# EAGLE design openLRS-APM (EAGLE 6.5.0)
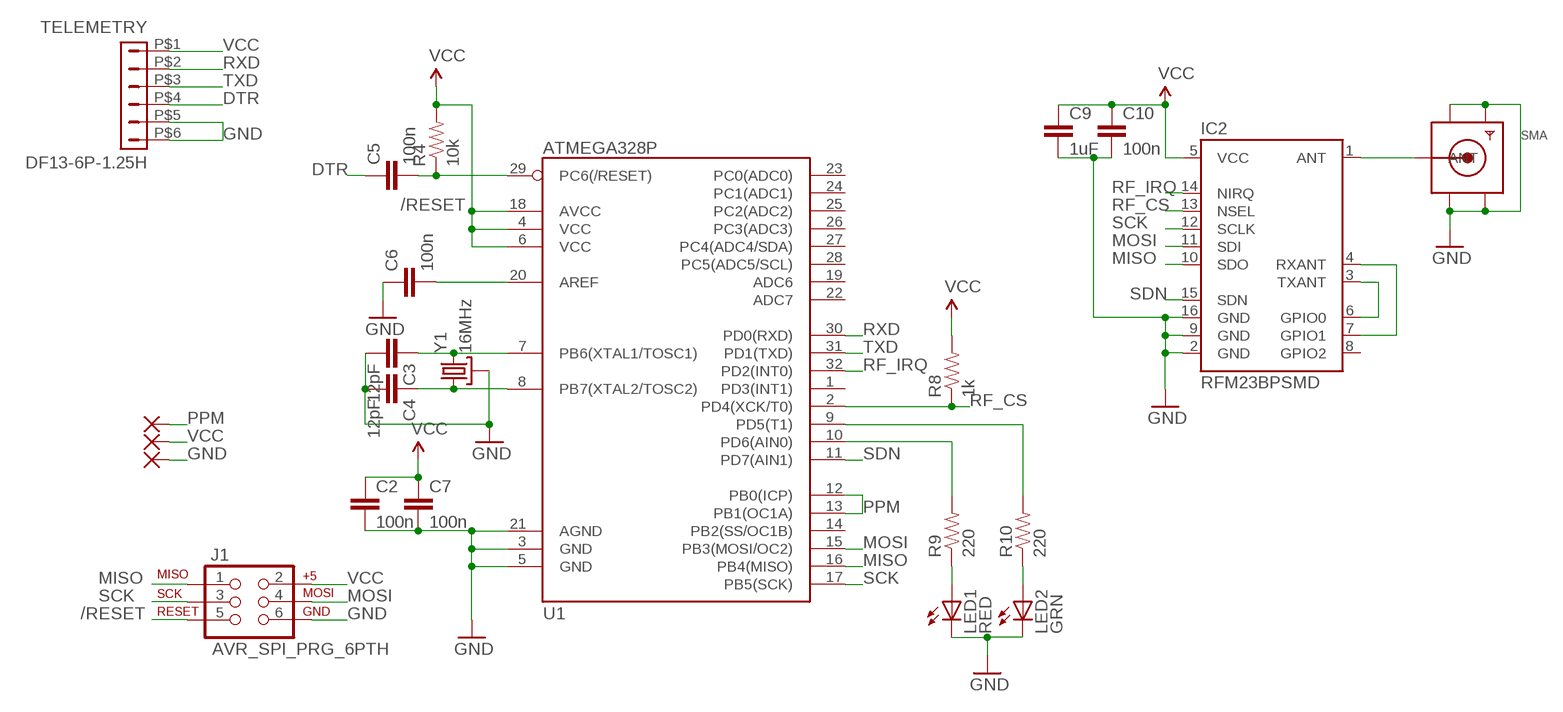
[diagram p0: schematic, sheet 1]

## Parts
C2  100n  CAP0805  [0805]
C3  12pF  CAP0805  [0805]
C4  12pF  CAP0805  [0805]
C5  100n  CAP0805  [0805]
C6  100n  CAP0805  [0805]
C7  100n  CAP0805  [0805]
C9  1uF  CAP0805  [0805]
C10  100n  CAP0805  [0805]
GND  WIREPADSMD1,27-254  [SMD1,27-2,54]
IC2  RFM23BPSMD  [RFM23BP-S2]
J1  AVR_SPI_PRG_6PTH  [2X3]
LED1  RED  LEDSML0805  [SML0805]
LED2  GRN  LEDSML0805  [SML0805]
PPM  WIREPADSMD1,27-254  [SMD1,27-2,54]
R4  10k  RESISTOR0805-RES  [0805]
R8  1k  RESISTOR0805-RES  [0805]
R9  220  RESISTOR0805-RES  [0805]
R10  220  RESISTOR0805-RES  [0805]
SMA  SMACONNECTOR_EDGE  [SMA_EDGELAUNCH]
TELEMETRY  DF13-6P-1.25H  [DF13A-6P-1.25H]
U1  ATMEGA328P  ATMEGA328_SMT  [TQFP32-08]
VCC  WIREPADSMD1,27-254  [SMD1,27-2,54]
Y1  16MHz  CRYSTAL3.2X2.5  [CRYSTAL-SMD-5X3]

## Nets
/RESET: C5.2 J1.5 R4.1 U1.29(PC6(/RESET))
DTR: C5.1 TELEMETRY.P$4
GND: C2.2 C3.2 C4.2 C6.1 C7.2 C9.2 C10.2 GND.1(P) IC2.2(GND) IC2.9(GND) IC2.16(GND) J1.6 LED1.C LED2.C SMA.GND@1(GND4) SMA.GND@2(GND3) SMA.GND@3(GND2) SMA.GND@4(GND1) TELEMETRY.P$5 TELEMETRY.P$6 U1.3(GND) U1.5(GND) U1.21(AGND) Y1.2(GND) Y1.4(GND)
MISO: IC2.10(SDO) J1.1 U1.16(PB4(MISO))
MOSI: IC2.11(SDI) J1.4 U1.15(PB3(MOSI/OC2))
N$1: IC2.3(TXANT) IC2.6(GPIO0)
N$2: IC2.4(RXANT) IC2.7(GPIO1)
N$7: R9.2 U1.10(PD6(AIN0))
N$8: R10.2 U1.9(PD5(T1))
N$9: LED2.A R10.1
N$10: LED1.A R9.1
N$11: C3.1 U1.7(PB6(XTAL1/TOSC1)) Y1.3
N$12: C4.1 U1.8(PB7(XTAL2/TOSC2)) Y1.1
N$13: IC2.1(ANT) SMA.P(ANT)
N$14: C6.2 U1.20(AREF)
PPM: PPM.1(P) U1.12(PB0(ICP)) U1.13(PB1(OC1A))
RF_CS: IC2.13(NSEL) R8.1 U1.2(PD4(XCK/T0))
RF_IRQ: IC2.14(NIRQ) U1.32(PD2(INT0))
RXD: TELEMETRY.P$2 U1.30(PD0(RXD))
SCK: IC2.12(SCLK) J1.3 U1.17(PB5(SCK))
SDN: IC2.15(SDN) U1.11(PD7(AIN1))
TXD: TELEMETRY.P$3 U1.31(PD1(TXD))
VCC: C2.1 C7.1 C9.1 C10.1 IC2.5(VCC) J1.2 R4.2 R8.2 TELEMETRY.P$1 U1.4(VCC) U1.6(VCC) U1.18(AVCC) VCC.1(P)
Unconnected: IC2.8(GPIO2) U1.1(PD3(INT1)) U1.14(PB2(SS/OC1B)) U1.19(ADC6) U1.22(ADC7) U1.23(PC0(ADC0)) U1.24(PC1(ADC1)) U1.25(PC2(ADC2)) U1.26(PC3(ADC3)) U1.27(PC4(ADC4/SDA)) U1.28(PC5(ADC5/SCL))

## Library data of the parts
C2-C7 C9 C10 = SparkFun-Capacitors:CAP: Capacitor Standard 0603 ceramic capacitor, and 0.1" leaded capacitor.
GND PPM VCC = wirepad:WIREPAD: Wire PAD connect wire on PCB
IC2 = RFM23:RFM23BP: The RFM23BP is a medium power, low cost radio that is capable of operating in the 434MHz and 900MHz open bands. It's frequency is software defined and there are some very good libraries written for it.
J1 = SparkFun-Connectors:AVR_SPI_PRG_6: AVR ISP 6 Pin This is the reduced ISP connector for AVR programming. Common on Arduino. This footprint will take up less PCB space and can be used with a 10-pin to 6-pin adapter such as SKU: BOB-08508
LED1 LED2 = led:LED: LED OSRAM: - CHIPLED LG R971, LG N971, LY N971, LG Q971, LY Q971, LO R971, LY R971 LH N974, LH R974 LS Q976, LO Q976, LY Q976 LO Q996 - Hyper CHIPLED LW Q18S LB Q993, LB Q99A, LB R99A - SideLED LS A670, LO A670, LY A670, LG A670, LP A670 LB A673, LV A673, LT A673, LW A673 LH A674 LY A675 LS A676, LA A676, LO A676, LY A676, LW A676 LS A679, LY A679, LG A679 - Hyper Micro SIDELED® LS Y876, LA Y876, LO Y876, LY Y876 LT Y87S - SmartLED LW L88C, LW L88S LB L89C, LB L89S, LG L890 LS L89K, LO L89K, LY L89K LS L896, LA L896, LO L896, LY L896 - TOPLED LS T670, LO T670, LY T670, LG T670, LP T670 LSG T670, LSP T670, LSY T670, LOP T670, LYG T670 LG T671, LOG T671, LSG T671 LB T673, LV T673, LT T673, LW T673 LH T674 LS T676, LA T676, LO T676, LY T676, LB T676, LH T676, LSB T676, LW T676 LB T67C, LV T67C, LT T67C, LS T67K, LO T67K, LY T67K, LW E67C LS E67B, LA E67B, LO E67B, LY E67B, LB E67C, LV E67C, LT E67C LW T67C LS T679, LY T679, LG T679 LS T770, LO T770, LY T770, LG T770, LP T770 LB T773, LV T773, LT T773, LW T773 LH T774 LS E675, LA E675, LY E675, LS T675 LS T776, LA T776, LO T776, LY T776, LB T776 LHGB T686 LT T68C, LB T68C - Hyper Mini TOPLED® LB M676 - Mini TOPLED Santana® LG M470 LS M47K, LO M47K, LY M47K Source: http://www.osram.convergy.de LUXEON: - LUMILED® LXK2-PW12-R00, LXK2-PW12-S00, LXK2-PW14-U00, LXK2-PW14-V00 LXK2-PM12-R00, LXK2-PM12-S00, LXK2-PM14-U00 LXK2-PE12-Q00, LXK2-PE12-R00, LXK2-PE12-S00, LXK2-PE14-T00, LXK2-PE14-U00 LXK2-PB12-K00, LXK2-PB12-L00, LXK2-PB12-M00, LXK2-PB14-N00, LXK2-PB14-P00, LXK2-PB14-Q00 LXK2-PR12-L00, LXK2-PR12-M00, LXK2-PR14-Q00, LXK2-PR14-R00 LXK2-PD12-Q00, LXK2-PD12-R00, LXK2-PD12-S00 LXK2-PH12-R00, LXK2-PH12-S00 LXK2-PL12-P00, LXK2-PL12-Q00, LXK2-PL12-R00 Source: www.luxeon.com KINGBRIGHT: KA-3528ASYC Source: www.kingbright.com
R4 R8-R10 = SparkFun-Resistors:RESISTOR: Resistor Basic schematic elements and footprints for 0603, 1206, and PTH resistors.
SMA = adafruit:SMACONNECTOR: SMA Connector 90° DIP SMA Connector, 50 Ohm (4UConnector: 07259)
TELEMETRY = con-hirose-df13:DF13-6P-1.25: DF13-6P 1.25mm Pitch Miniature Crimping Connector.
U1 = SparkFun-DigitalIC:ATMEGA328_SMT: 32-Pin Atmega328 part Commonly used on Arduino compatible boards Available in QFP and QFN packages TQFP is IC-09069 QFN is non-stock; PROD_ID: IC-09069
Y1 = crystal_3225:CRYSTAL: Various standard crystals. Proven footprints. Spark Fun Electronics SKU : COM-00534

## Net classes
0 default: clearance 0.205 mm

## Board
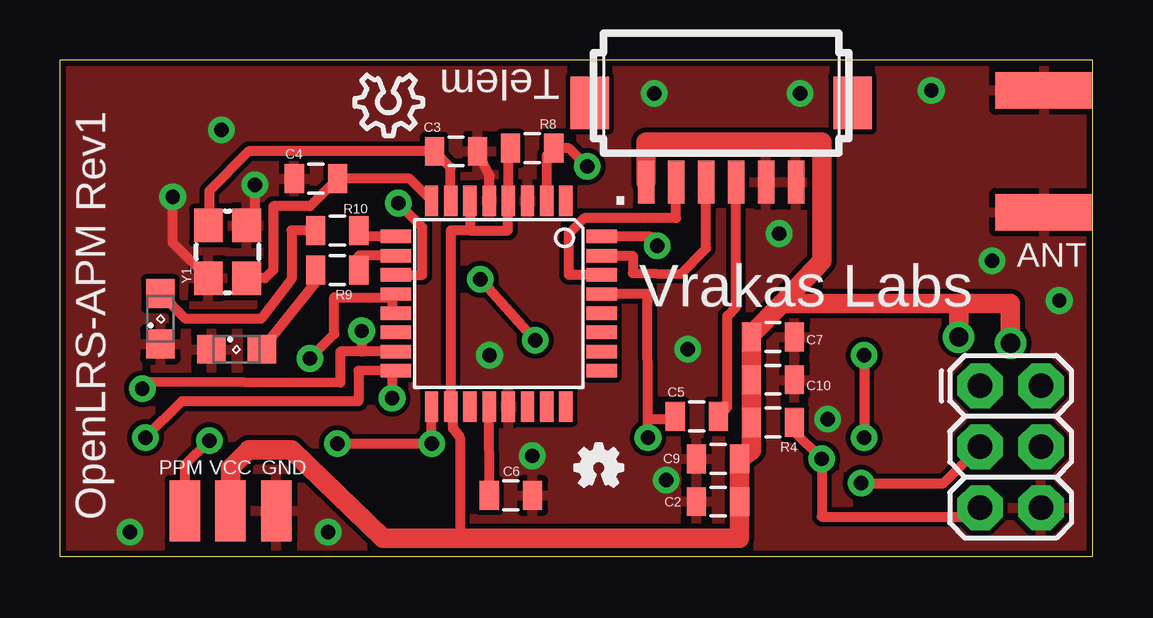
[diagram p1: board, top side]
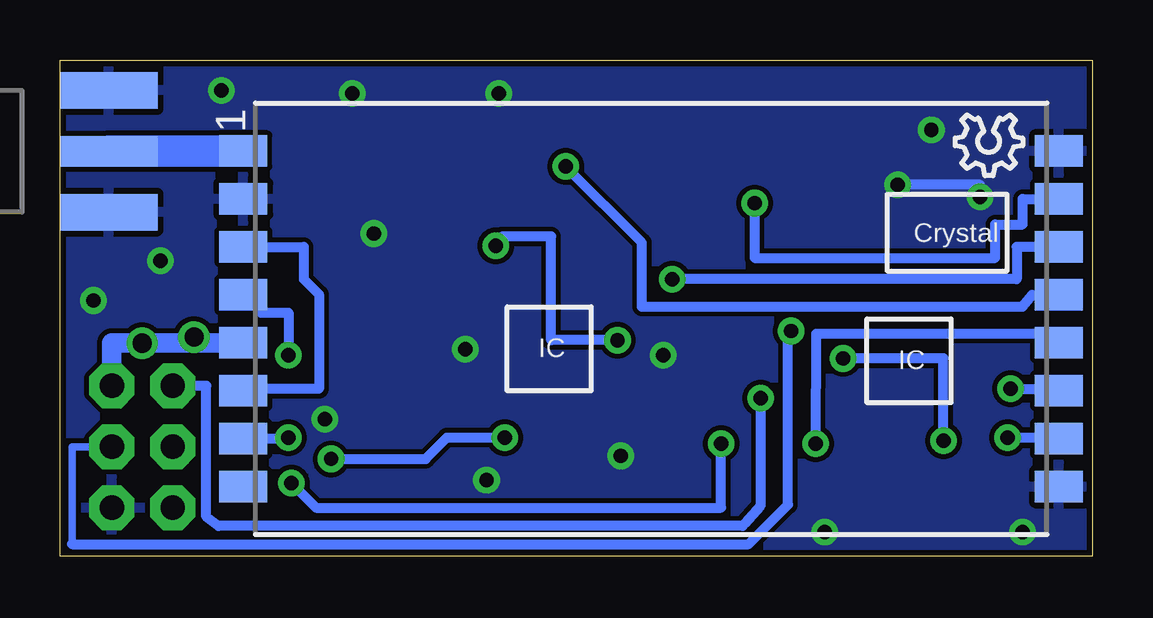
[diagram p2: board, bottom side, seen from below]

Size 43.05 x 20.7 mm. Coordinates in mm from the lower left corner, seen from the top.
Outline: 0,0 0,20.7 43.05,20.7 43.05,0 0,0
Copper layers (1*16): Top 0.035mm / dielectric 1.5mm / Bottom 0.035mm
Design rules "SparkFun": minimum track width 8mil, minimum drill 20mil, track to track 8mil, track to pad 8mil, pad to pad 8mil, via to via 8mil, smd to smd 8mil, copper to edge 10mil, drill to drill 8mil, minimum pad ring 12mil, minimum via ring 10mil, stop-mask expansion 4mil, vias tented up to drill 25mil, thermal gap 10mil

### Footprints (pad centres in the part's own frame; a part is rotated, then mirrored left to right if it is on the bottom)
0805 = smd 0.8 x 1.2: 1 -0.9,0; 2 0.9,0
SMD1,27-2,54 = smd 1.27 x 2.54: 1 0,0
RFM23BP-S2 = smd 2 x 1.3: 1 -17,7; 2 -17,5; 3 -17,3; 4 -17,1; 5 -17,-1; 6 -17,-3; 7 -17,-5; 8 -17,-7; 9 17,-7; 10 17,-5; 11 17,-3; 12 17,-1; 13 17,1; 14 17,3; 15 17,5; 16 17,7
2X3 = drill 1.016 pad 1.88 octagon: 1 0,0; 2 0,2.54; 3 2.54,0; 4 2.54,2.54; 5 5.08,0; 6 5.08,2.54
SML0805 = smd 1.2 x 1.2: A 1.05,0; C -1.05,0
SMA_EDGELAUNCH = smd 4.064 x 1.524: GND@1 2.032,-2.54; GND@2 2.032,2.54 | smd 4.064 x 1.524 bottom: GND@3 2.032,2.54; GND@4 2.032,-2.54 | smd 4.064 x 1.27: P 2.032,0
DF13A-6P-1.25H = smd 1.6 x 2.2: M$0 -5.475,2.4; M$1 5.475,2.4 | smd 0.7 x 1.8: P$1 -3.125,-0.9; P$2 -1.875,-0.9; P$3 -0.625,-0.9; P$4 0.625,-0.9; P$5 1.875,-0.9; P$6 3.125,-0.9
TQFP32-08 = smd 1.27 x 0.559: 1 -4.293,2.8; 2 -4.293,2; 3 -4.293,1.2; 4 -4.293,0.4; 5 -4.293,-0.4; 6 -4.293,-1.2; 7 -4.293,-2; 8 -4.293,-2.8; 17 4.293,-2.8; 18 4.293,-2; 19 4.293,-1.2; 20 4.293,-0.4; 21 4.293,0.4; 22 4.293,1.2; 23 4.293,2; 24 4.293,2.8 | smd 0.559 x 1.27: 9 -2.8,-4.293; 10 -2,-4.293; 11 -1.2,-4.293; 12 -0.4,-4.293; 13 0.4,-4.293; 14 1.2,-4.293; 15 2,-4.293; 16 2.8,-4.293; 25 2.8,4.293; 26 2,4.293; 27 1.2,4.293; 28 0.4,4.293; 29 -0.4,4.293; 30 -1.2,4.293; 31 -2,4.293; 32 -2.8,4.293
CRYSTAL-SMD-5X3 = smd 1.4 x 1.2: 1 -1.1,-0.8; 2 1.1,-0.8; 3 1.1,0.8; 4 -1.1,0.8

### Placement (x,y rotation side)
C2  27.43,2.29 180 top
C3  16.51,16.89 0 top
C4  10.67,15.75 180 top
C5  26.54,5.84 180 top
C6  18.8,2.54 180 top
C7  29.72,9.14 0 top
C9  27.43,4.06 180 top
C10  29.72,7.37 0 top
GND  9.02,1.91 180 top
IC2  18.41,9.91 0 bottom
J1  38.35,7.11 270 top
LED1  7.37,8.64 0 top
LED2  4.19,9.91 90 top
PPM  5.21,1.91 0 top
R4  29.72,5.59 180 top
R8  19.68,17.02 180 top
R9  11.56,11.94 0 top
R10  11.56,13.59 0 top
SMA  43.05,16.89 0 bottom
TELEMETRY  27.56,16.51 0 top
U1  18.29,10.54 270 top
U$1  [OSHW_FILLX70_NOTEXT]  21.46,2.92 0 top
U$2  [OSHW_8X100_NOTEXT]  15.11,20.07 180 top
U$3  [OSHW_8X100_NOTEXT]  2.92,18.41 180 bottom
VCC  7.11,1.91 180 top
Y1  6.99,12.7 90 top

### Tracks (layer width: path | path; a pad name or v marks a point on that pad's centre or on a via)
/RESET  (via drill 0.6)
  Top 0.406: v31.75,4.06 31.75,1.65 37.97,1.65 J1.5 | v24.51,4.95 24.51,5.71 | 24.51,5.71 24.49,10.67 24.49,10.94 U1.29 | v31.75,4.06 30.62,5.2 R4.1 | 31.75,4.08 v31.75,4.06 | C5.2 25.52,5.71 24.51,5.71
  Bottom 0.406: v31.75,4.06 27.81,4.06 26.92,4.95 v24.51,4.95
DTR
  Top 0.406: C5.1 27.81,6.21 27.81,10.03 28.18,10.4 TELEMETRY.P$4
GND  (via drill 0.6)
  Top 0.406: U1.5 17.91,15.88 C3.2 | Y1.2 8.13,13.8 v8.13,15.49 | Y1.4 4.7,13.09 v4.7,14.99
  Bottom 0.203: 1.42,16.89 IC2.16
  Bottom 0.406: v4.7,14.99 4.7,15.49 v8.13,15.49
  other vias: 19.68,4.19 32,5.71 11.18,1.02 2.92,1.02 26.16,8.64 41.66,10.67 36.32,19.43 17.91,8.38 29.97,13.46 30.86,19.3 24.77,19.3 25.27,3.17 38.86,12.32 6.73,17.78
  pour Top: -2.79,27.3 58.17,27.3 58.17,1.4 58.17,-5.46 -4.06,-5.46 -4.06,27.43 -3.17,27.43 -3.17,27.3
  pour Bottom: -4.57,25.78 54.86,25.78 54.86,11.3 54.86,-3.43 -6.86,-3.43 -6.86,25.78
MISO  (via drill 0.6)
  Top 0.406: v3.56,4.95 5.07,6.47 12.45,6.47 12.45,7.75 U1.16 13.84,7.74 v13.84,6.6
  Bottom 0.406: v3.56,4.95 1.46,4.95 IC2.10 | J1.1 36.96,7.11 36.96,1.65 36.45,1.27 14.61,1.27 14.5,1.37 13.84,2.13 v13.84,6.6
MOSI  (via drill 0.6)
  Top 0.406: U1.15 12.57,8.54 | 12.57,8.54 11.68,8.54 11.68,7.24 3.71,7.27 v3.43,6.99 | v12.57,9.4 12.57,8.54
  Bottom 0.305: J1.4 42.55,4.57 42.55,0.51
  Bottom 0.406: v3.43,6.99 1.49,6.99 IC2.11 | 42.55,0.51 14.35,0.51 12.7,2.16 12.7,9.27 v12.57,9.4
N$1
  Bottom 0.406: IC2.3 32.89,12.91 32.89,11.56 32.26,10.92 32.26,6.99 35.41,6.99 IC2.6
N$2  (via drill 0.6)
  Top 0.406: v33.53,8.38 v33.53,4.95
  Bottom 0.406: IC2.4 34.67,10.16 33.53,10.16 v33.53,8.38 | v33.53,4.95 33.96,4.91 IC2.7
N$7
  Top 0.406: U1.10 12.46,12.54 R9.2
N$8
  Top 0.406: U1.9 12.58,13.34 R10.2
N$9
  Top 0.406: R10.1 9.65,13.59 9.65,11.56 8.38,9.91 5.24,9.91 LED2.A
N$10
  Top 0.406: R9.1 10.66,11.44 LED1.A
N$11
  Top 0.406: U1.7 16.29,16.21 C3.1 7.87,16.89 6.22,15.24 6.22,13.84 Y1.3
N$12
  Top 0.406: U1.8 14.57,15.75 C4.1 10.43,14.61 8.89,14.61 8.89,11.94 8.55,11.6 Y1.1
N$13
  Bottom 1.321: IC2.1 SMA.P
N$14
  Top 0.406: C6.2 U1.20
PPM  (via drill 0.6)
  Top 0.406: v6.22,4.83 5.21,3.81 PPM.1 | v10.41,8.26 11.43,9.27 11.43,10.79 13.85,10.79 | 13.85,10.79 U1.12 | 13.85,10.79 13.85,10.29 U1.13
  Bottom 0.406: v6.22,4.83 6.22,8.26 v10.41,8.26
RF_CS  (via drill 0.6)
  Top 0.406: U1.2 20.29,16.72 R8.1 21.21,17.02 v21.97,16.26
  Bottom 0.406: IC2.13 2.52,10.91 2.92,10.41 18.8,10.41 18.8,13.08 v21.97,16.26
RF_IRQ  (via drill 0.6)
  Top 0.406: v17.53,11.56 v19.81,9.02 | v24.89,12.95 24.64,12.95 24.64,13.34 U1.32
  Bottom 0.406: v19.81,9.02 22.58,9.02 U1.32 24.64,13.34 24.64,12.95 v24.89,12.95 | IC2.14 3.17,12.91 3.17,11.56 v17.53,11.56
RXD
  Top 0.406: U1.30 21.21,11.74 21.21,13.46 21.84,14.1 25.68,14.1 TELEMETRY.P$2
SCK  (via drill 0.6)
  Top 0.406: v33.4,3.05 36.83,3.05 J1.3 | U1.17 v15.49,4.7 v11.56,4.7
  Bottom 0.406: 2.17,8.91 IC2.12 1.8,9.29 11.54,9.29 v11.56,4.7 | v33.4,3.05 32.38,2.03 15.49,2.03 v15.49,4.7
SDN  (via drill 0.6)
  Top 0.406: v14.1,14.73 15.11,13.72 15.11,11.74 U1.11
  Bottom 0.406: v14.1,14.73 14.1,12.45 4.06,12.45 4.06,13.84 2.92,13.84 2.92,14.91 IC2.15 1.42,14.73
TXD
  Top 0.406: U1.31 23.88,12.54 23.88,11.81 25.88,11.78 26.93,12.84 TELEMETRY.P$3
VCC  (via drill 0.8)
  Top 0.406: 16.67,0.76 16.67,4.95 16.38,5.33 U1.18 16.29,13.59 17.09,13.59 | U1.6 17.09,13.59 | 17.09,13.59 18.67,13.59 18.67,14.83 U1.4 18.69,16.92 R8.2 | 28.82,9.26 C7.1
  Top 0.813: VCC.1 7.11,3.68 7.87,4.45 9.65,4.45 13.46,0.76 16.67,0.76 28.33,0.76 C2.1 C9.1 28.82,4.42 R4.2 C10.1 C7.1 | 30.1,10.54 28.82,9.26 | v37.47,9.14 37.47,10.54 | 37.47,10.54 30.1,10.54 | 30.1,10.54 31.75,12.32 31.75,17.27 24.43,17.27 TELEMETRY.P$1 | v39.62,8.89 39.62,10.54 37.47,10.54
  Bottom 0.406: 37.72,8.89 37.47,8.91
  Bottom 0.813: J1.2 40.89,8.91 37.47,8.91 IC2.5 | v37.47,9.14 37.72,8.89

### Text on the board
tPlace: Vrakas Labs | OpenLRS-APM Rev1
tNames: Telem | ANT
bNames: 1